# Altium project QSTL_M12C_BNC_v2.PrjPcb
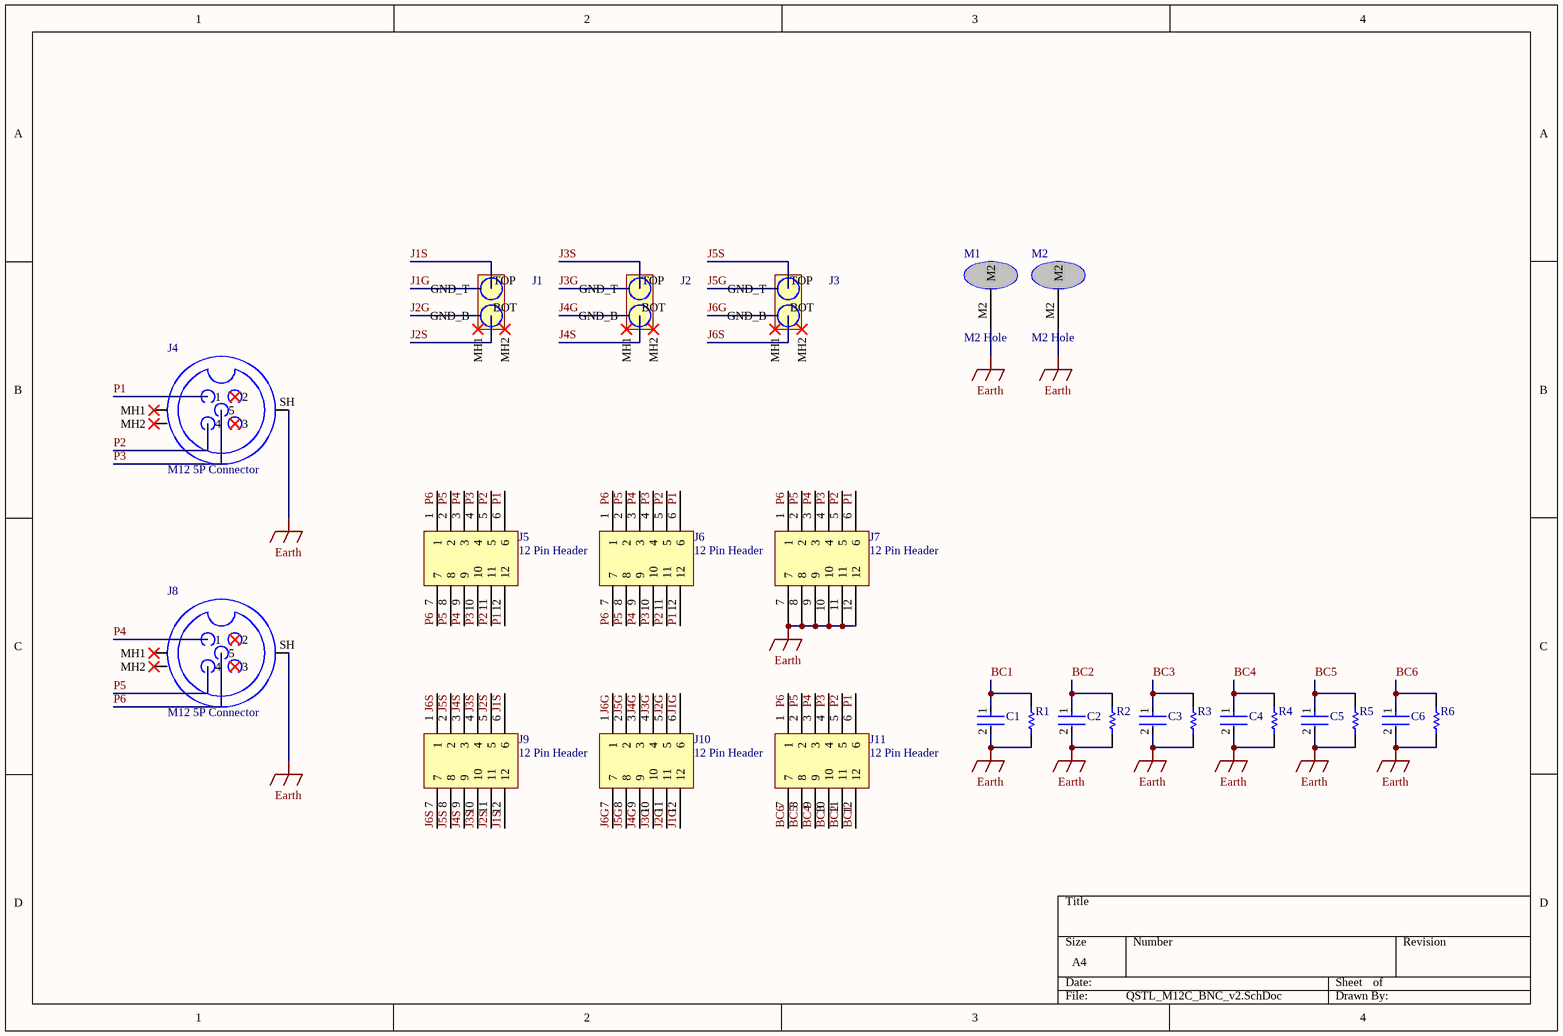
[diagram p0: QSTL_M12C_BNC_v2.SchDoc]
1 sheet, 25 parts. Net scope: global (net labels, ports and power ports of the same name join across sheets).
Board file: QSTL_M12C_BNC_v2.PcbDoc

## Sheet QSTL_M12C_BNC_v2.SchDoc
size A4; SheetNumber: 1; SheetTotal: 1

### Parts
C1  Murata 0805  [FP-GRM21B-0_15-MFG]  (value not drawn)
C2  Murata 0805  [FP-GRM21B-0_15-MFG]  (value not drawn)
C3  Murata 0805  [FP-GRM21B-0_15-MFG]  (value not drawn)
C4  Murata 0805  [FP-GRM21B-0_15-MFG]  (value not drawn)
C5  Murata 0805  [FP-GRM21B-0_15-MFG]  (value not drawn)
C6  Murata 0805  [FP-GRM21B-0_15-MFG]  (value not drawn)
J1  Isolated Stacked BNC  [031-6575]  (value not drawn)
J2  Isolated Stacked BNC  [031-6575]  (value not drawn)
J3  Isolated Stacked BNC  [031-6575]  (value not drawn)
J4  M12 5P Connector  [861-B05-213R004]
J5  12 Pin Header  [PZ254-2-06-S]
J6  12 Pin Header  [PZ254-2-06-S]
J7  12 Pin Header  [PZ254-2-06-S]
J8  M12 5P Connector  [861-B05-213R004]
J9  12 Pin Header  [PZ254-2-06-S]
J10  12 Pin Header  [PZ254-2-06-S]
J11  12 Pin Header  [PZ254-2-06-S]
M1  M2 Hole  [M2_Hole]
M2  M2 Hole  [M2_Hole]
R1  Panasonic 0805  [RESC2013X60X40LL20T25]  (value not drawn)
R2  Panasonic 0805  [RESC2013X60X40LL20T25]  (value not drawn)
R3  Panasonic 0805  [RESC2013X60X40LL20T25]  (value not drawn)
R4  Panasonic 0805  [RESC2013X60X40LL20T25]  (value not drawn)
R5  Panasonic 0805  [RESC2013X60X40LL20T25]  (value not drawn)
R6  Panasonic 0805  [RESC2013X60X40LL20T25]  (value not drawn)

### Nets
Earth: C1.2 C2.2 C3.2 C4.2 C5.2 C6.2 J4.SH J7.7 J7.8 J7.9 J7.10 J7.11 J7.12 J8.SH M1.M2 M2.M2 R1.2 R2.2 R3.2 R4.2 R5.2 R6.2
BC1: C1.1 J11.12 R1.1
BC2: C2.1 J11.11 R2.1
BC3: C3.1 J11.10 R3.1
BC4: C4.1 J11.9 R4.1
BC5: C5.1 J11.8 R5.1
BC6: C6.1 J11.7 R6.1
J1G: J1.GND_T J10.6 J10.12
J1S: J1.TOP J9.6 J9.12
J2G: J1.GND_B J10.5 J10.11
J2S: J1.BOT J9.5 J9.11
J3G: J2.GND_T J10.4 J10.10
J3S: J2.TOP J9.4 J9.10
J4G: J2.GND_B J10.3 J10.9
J4S: J2.BOT J9.3 J9.9
J5G: J3.GND_T J10.2 J10.8
J5S: J3.TOP J9.2 J9.8
J6G: J3.GND_B J10.1 J10.7
J6S: J3.BOT J9.1 J9.7
P1: J4.1 J5.6 J5.12 J6.6 J6.12 J7.6 J11.6
P2: J4.4 J5.5 J5.11 J6.5 J6.11 J7.5 J11.5
P3: J4.5 J5.4 J5.10 J6.4 J6.10 J7.4 J11.4
P4: J5.3 J5.9 J6.3 J6.9 J7.3 J8.1 J11.3
P5: J5.2 J5.8 J6.2 J6.8 J7.2 J8.4 J11.2
P6: J5.1 J5.7 J6.1 J6.7 J7.1 J8.5 J11.1

Not connected (* = marked no-connect by the designer): J1 MH1* MH2*; J2 MH1* MH2*; J3 MH1* MH2*; J4 2* 3* MH1 MH2; J8 2* 3* MH1 MH2

### Library data of the parts
C1-C6 = CMP-2000-07555-2: Chip Multilayer Ceramic Capacitors for General Purpose, 0805, 10uF, X7R, 15%, 10%, 10V; Length: 2mm; Case Code (Metric): 2012; Height: 1.25mm; Tolerance: 10%; Width: 1.25mm; Voltage Rating: 10V; Voltage Rating (DC): 10V; Case/Package: 0805; Package Quantity: 3000; Capacitance: 10uF; REACH SVHC: No SVHC; Case Code (Imperial): 0805; Min Operating Temperature: -55°C; Termination: SMD/SMT; Depth: 1.25mm; Mount: Surface Mount; Thickness: 0.055inch; Max Operating Temperature: 125°C; Weight: 0.000335oz; Dielectric: X7R; Packaging: Tape and Reel
J1-J3 = 031-6575: https://www.digikey.ca/en/products/detail/amphenol-rf/031-6575/4037241
J4 J8 = 861-B05-213R004: https://www.digikey.ca/en/products/detail/norcomp-inc/861-B05-213R004/22611951?s=N4IgTCBcDaIBwDYCMBaAQgBgKwrEgzAEoYYAsIAugL5A
J5-J7 J9-J11 = PZ254-2-06-S: https://jlcpcb.com/partdetail/HCTL-PZ254_2_06S/C3294464
M1 M2 = M2_Hole
R1-R6 = CMP-2001-00613-1: Part Number: ERA6AEB222V; Manufacturer: Panasonic